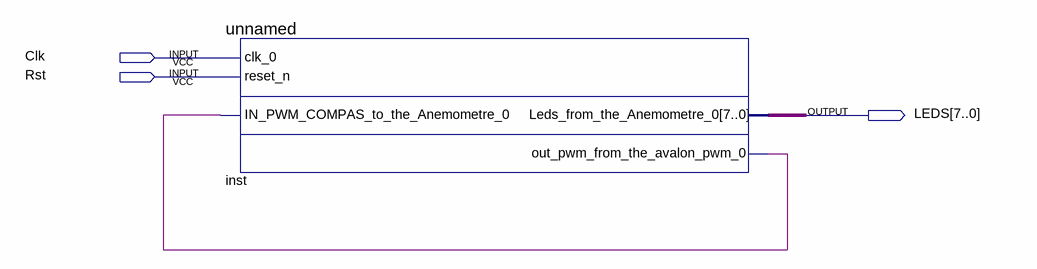
[diagram p0: schematic sheet]
// Quartus schematic CPU_anemometre.bdf as structural Verilog: 1 symbols, 3 pins
module CPU_anemometre (
  input  Clk,
  input  Rst,
  output [7:0] LEDS
);

  wire inst_out_pwm_from_the_avalon_pwm_0;

  unnamed inst (
    .clk_0(Clk), .reset_n(Rst), .IN_PWM_COMPAS_to_the_Anemometre_0(inst_out_pwm_from_the_avalon_pwm_0),
    .Leds_from_the_Anemometre_0(LEDS), .out_pwm_from_the_avalon_pwm_0(inst_out_pwm_from_the_avalon_pwm_0));
endmodule
